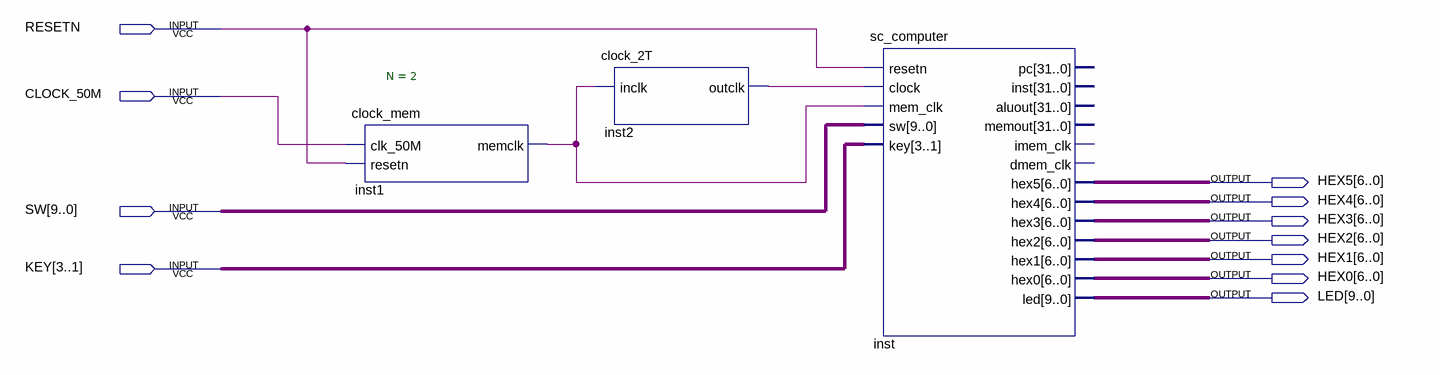
[diagram p0: schematic sheet]
// Quartus schematic sc_computer_01.bdf as structural Verilog: 3 symbols, 11 pins
module sc_computer_01 (
  input  RESETN,
  input  CLOCK_50M,
  input  [9:0] SW,
  input  [3:1] KEY,
  output [6:0] HEX5,
  output [6:0] HEX4,
  output [6:0] HEX3,
  output [6:0] HEX2,
  output [6:0] HEX1,
  output [6:0] HEX0,
  output [9:0] LED
);

  wire inst1_memclk, inst2_outclk;

  clock_mem #(.N(2)) inst1 (.clk_50M(CLOCK_50M), .resetn(RESETN), .memclk(inst1_memclk));
  clock_2T inst2 (.inclk(inst1_memclk), .outclk(inst2_outclk));
  sc_computer inst (
    .resetn(RESETN), .clock(inst2_outclk), .mem_clk(inst1_memclk), .sw(SW), .key(KEY), .hex5(HEX5),
    .hex4(HEX4), .hex3(HEX3), .hex2(HEX2), .hex1(HEX1), .hex0(HEX0), .led(LED));  // open: pc, inst, aluout, memout, imem_clk, dmem_clk
endmodule
